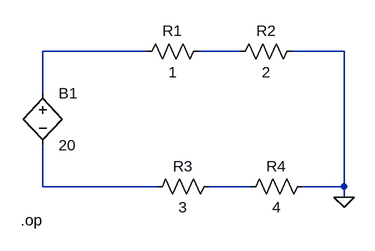
[diagram p0: schematic kolo.asc]
kolo.asc, the LTspice schematic file:
Version 4
SHEET 1 880 680
WIRE 80 48 -80 48
WIRE 224 48 160 48
WIRE 384 48 304 48
WIRE -80 112 -80 48
WIRE -80 256 -80 192
WIRE 96 256 -80 256
WIRE 240 256 176 256
WIRE 384 256 384 48
WIRE 384 256 320 256
WIRE 384 272 384 256
FLAG 384 272 0
SYMBOL bv -80 96 R0
SYMATTR InstName B1
SYMATTR Value 20
SYMATTR Prefix C
SYMBOL res 176 32 R90
WINDOW 0 0 56 VBottom 2
WINDOW 3 32 56 VTop 2
SYMATTR InstName R1
SYMATTR Value 1
SYMBOL res 320 32 R90
WINDOW 0 0 56 VBottom 2
WINDOW 3 32 56 VTop 2
SYMATTR InstName R2
SYMATTR Value 2
SYMBOL res 192 240 R90
WINDOW 0 0 56 VBottom 2
WINDOW 3 32 56 VTop 2
SYMATTR InstName R3
SYMATTR Value 3
SYMBOL res 336 240 R90
WINDOW 0 0 56 VBottom 2
WINDOW 3 32 56 VTop 2
SYMATTR InstName R4
SYMATTR Value 4
TEXT -114 308 Left 2 !.op

The netlist it stands for:
* kolo.asc
C§B1 N001 N003 20
R1 N002 N001 1
R2 0 N002 2
R3 N004 N003 3
R4 0 N004 4
.op
.backanno
.end